# EAGLE design ft232-breakout (EAGLE 6.5.0)
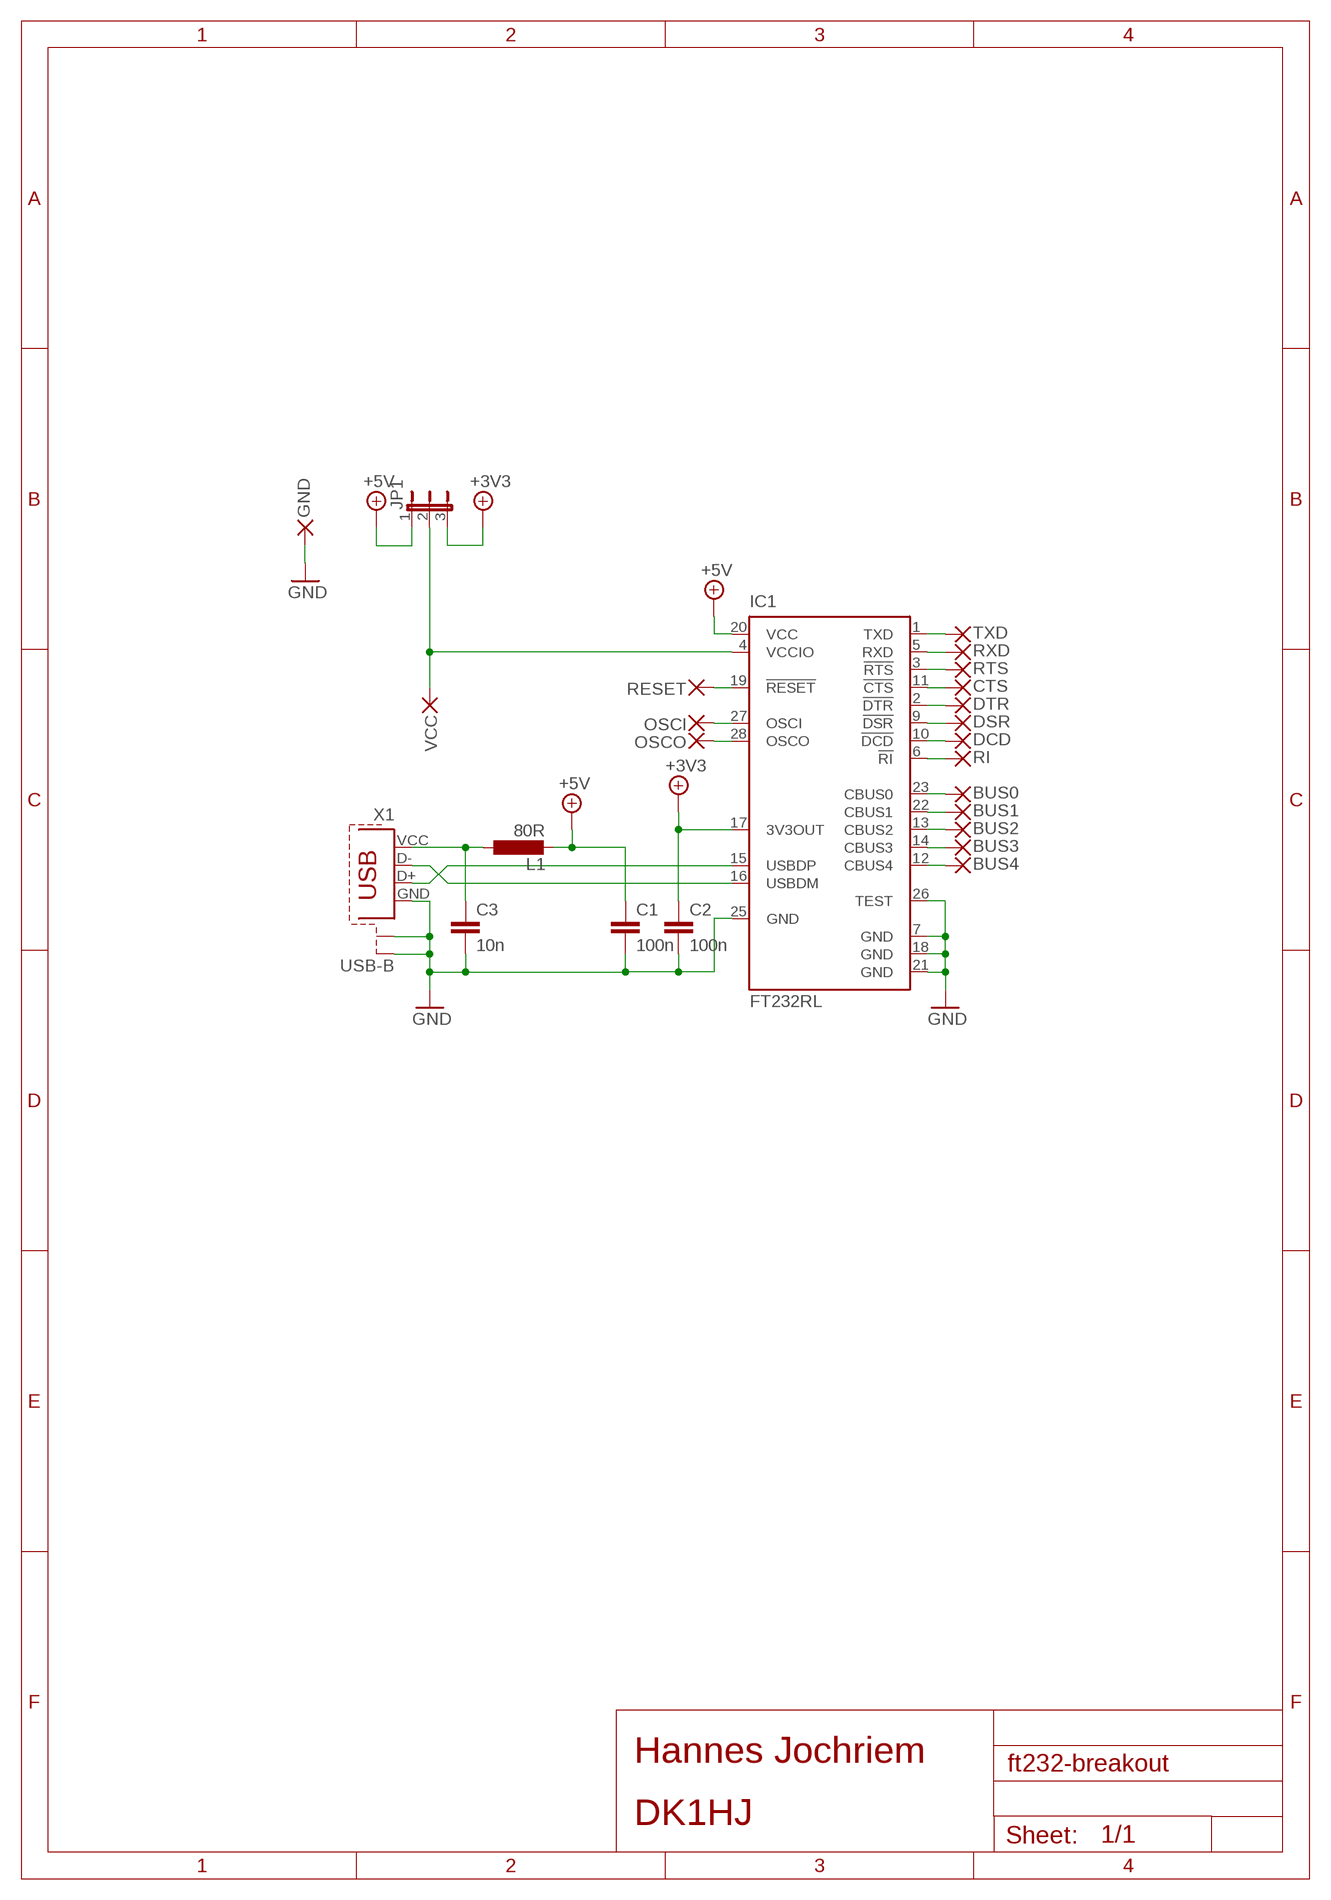
[diagram p0: schematic, sheet 1]

## Parts
BUS0  WIREPAD2,15/1,0  [2,15/1,0]
BUS1  WIREPAD2,15/1,0  [2,15/1,0]
BUS2  WIREPAD2,15/1,0  [2,15/1,0]
BUS3  WIREPAD2,15/1,0  [2,15/1,0]
BUS4  WIREPAD2,15/1,0  [2,15/1,0]
C1  100n  CC0805  [C0805]
C2  100n  CC0805  [C0805]
C3  10n  CC0805  [C0805]
CTS  WIREPAD2,15/1,0  [2,15/1,0]
DCD  WIREPAD2,15/1,0  [2,15/1,0]
DSR  WIREPAD2,15/1,0  [2,15/1,0]
DTR  WIREPAD2,15/1,0  [2,15/1,0]
GND  WIREPAD2,15/1,0  [2,15/1,0]
IC1  FT232RL  [SSOP28]
JP1  JP2E  [JP2]
L1  80R  LL2012C  [L2012C]
OSCI  WIREPAD2,15/1,0  [2,15/1,0]
OSCO  WIREPAD2,15/1,0  [2,15/1,0]
RESET  WIREPAD2,15/1,0  [2,15/1,0]
RI  WIREPAD2,15/1,0  [2,15/1,0]
RTS  WIREPAD2,15/1,0  [2,15/1,0]
RXD  WIREPAD2,15/1,0  [2,15/1,0]
TXD  WIREPAD2,15/1,0  [2,15/1,0]
VCC  WIREPAD2,15/1,0  [2,15/1,0]
X1  USB-B  [PN61729-S]

## Nets
+3V3: C2.1 IC1.17(3V3OUT) JP1.3
+5V: C1.1 IC1.20(VCC) JP1.1 L1.2
GND: C1.2 C2.2 C3.2 GND.1(P) IC1.7(GND) IC1.18(GND) IC1.21(GND) IC1.25(GND) IC1.26(TEST) X1.GND X1.S1 X1.S2
N$1: IC1.16(USBDM) X1.D-
N$2: IC1.15(USBDP) X1.D+
N$3: BUS3.1(P) IC1.14(CBUS3)
N$4: C3.1 L1.1 X1.VCC
N$5: BUS2.1(P) IC1.13(CBUS2)
N$6: BUS1.1(P) IC1.22(CBUS1)
N$8: BUS0.1(P) IC1.23(CBUS0)
N$9: IC1.6(!RI) RI.1(P)
N$10: BUS4.1(P) IC1.12(CBUS4)
N$11: DCD.1(P) IC1.10(!DCD)
N$12: DSR.1(P) IC1.9(!DSR)
N$13: DTR.1(P) IC1.2(!DTR)
N$14: CTS.1(P) IC1.11(!CTS)
N$15: IC1.3(!RTS) RTS.1(P)
N$16: IC1.5(RXD) RXD.1(P)
N$17: IC1.1(TXD) TXD.1(P)
N$18: IC1.19(!RESET) RESET.1(P)
N$19: IC1.27(OSCI) OSCI.1(P)
N$20: IC1.28(OSCO) OSCO.1(P)
N$21: IC1.4(VCCIO) JP1.2 VCC.1(P)

## Library data of the parts
BUS0 BUS1-BUS4 CTS DCD DSR DTR GND OSCI OSCO RESET RI RTS RXD TXD VCC = wirepad:WIREPAD: Wire PAD connect wire on PCB
C1-C3 = rcl:C: CAPACITOR, European symbol
IC1 = ftdichip:FT232R: Source: http://www.ftdichip.com/Documents/DataSheets/DS_FT232R_v104.pdf
JP1 = jumper:JP2E: JUMPER
L1 = rcl:L: INDUCTOR, European symbol
X1 = connectors:USB-B: BERG USB connector

## Board
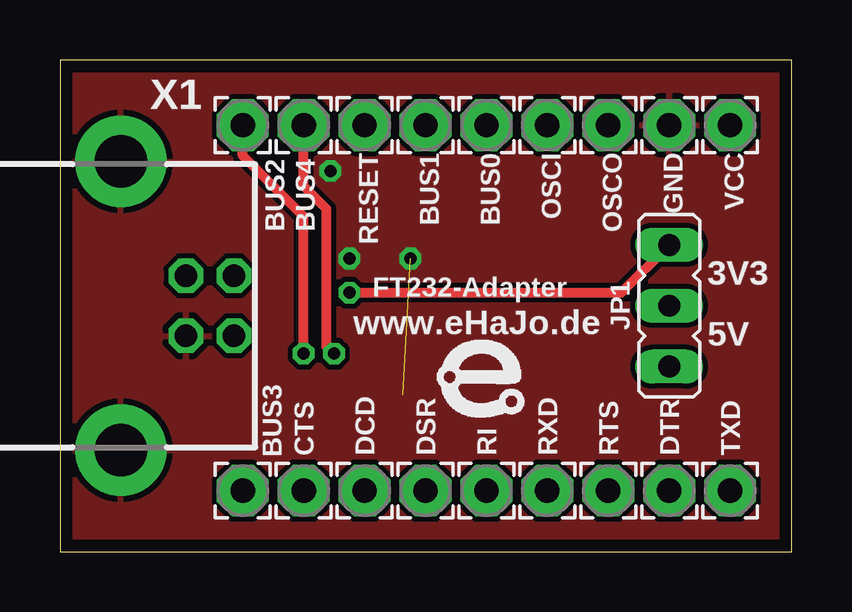
[diagram p1: board, top side]
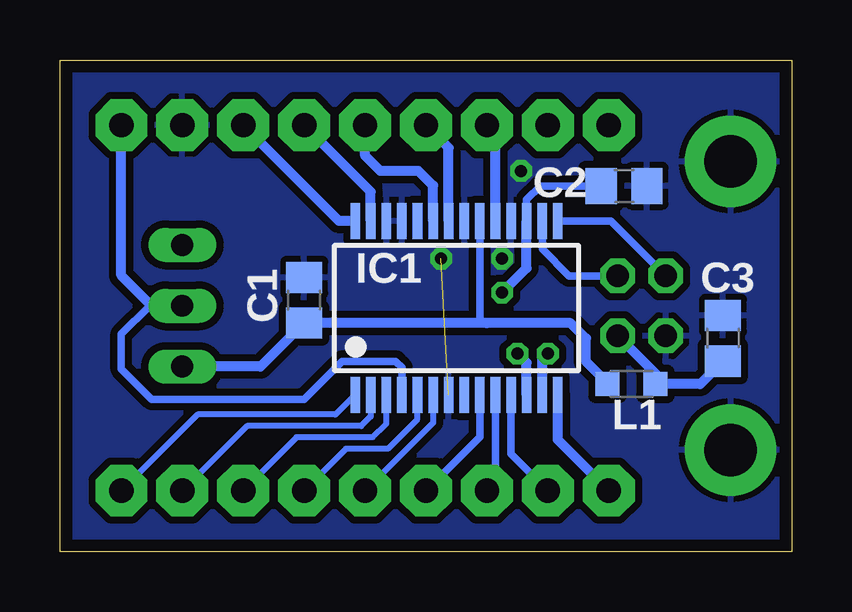
[diagram p2: board, bottom side, seen from below]

Size 30.5 x 20.5 mm. Coordinates in mm from the lower left corner, seen from the top.
Outline: 0,0 30.5,0 30.5,20.5 0,20.5 0,0
Copper layers (1*16): Top 0.035mm / dielectric 1.5mm / Bottom 0.035mm
Design rules "default *": minimum track width 10mil, minimum drill 24mil, track to track 8mil, track to pad 8mil, pad to pad 8mil, via to via 8mil, smd to smd 8mil, copper to edge 20mil, drill to drill 8mil, minimum pad ring 10mil, minimum via ring 8mil, stop-mask expansion 4mil, vias tented up to drill 0mil, thermal gap 10mil

### Footprints (pad centres in the part's own frame; a part is rotated, then mirrored left to right if it is on the bottom)
2,15/1,0 = drill 1.016 pad 2.159 octagon: 1 0,0
C0805 = smd 1.3 x 1.5: 1 -0.95,0; 2 0.95,0
SSOP28 = smd 0.4 x 1.5: 1 -4.225,-3.625; 2 -3.575,-3.625; 3 -2.925,-3.625; 4 -2.275,-3.625; 5 -1.625,-3.625; 6 -0.975,-3.625; 7 -0.325,-3.625; 8 0.325,-3.625; 9 0.975,-3.625; 10 1.625,-3.625; 11 2.275,-3.625; 12 2.925,-3.625; 13 3.575,-3.625; 14 4.225,-3.625; 15 4.225,3.625; 16 3.575,3.625; 17 2.925,3.625; 18 2.275,3.625; 19 1.625,3.625; 20 0.975,3.625; 21 0.325,3.625; 22 -0.325,3.625; 23 -0.975,3.625; 24 -1.625,3.625; 25 -2.275,3.625; 26 -2.925,3.625; 27 -3.575,3.625; 28 -4.225,3.625
JP2 = drill 0.914 long: 1 -2.54,0; 2 0,0; 3 2.54,0
L2012C = smd 1 x 1: 1 -1,0; 2 1,0
PN61729-S = drill 0.95 octagon: D+ -1.25,2.71; D- -1.25,4.71; GND 1.25,2.71; VCC 1.25,4.71 | drill 2.2 pad 3.81: S1 -6.02,0; S2 6.02,0

### Placement (x,y rotation side)
BUS0  17.78,17.78 0 top
BUS1  15.24,17.78 0 top
BUS2  7.62,17.78 0 top
BUS3  7.62,2.54 0 top
BUS4  10.16,17.78 0 top
C1  20.32,10.48 90 bottom
C2  6.99,15.24 0 bottom
C3  2.86,8.89 90 bottom
CTS  10.16,2.54 0 top
DCD  12.7,2.54 0 top
DSR  15.24,2.54 0 top
DTR  25.4,2.54 0 top
GND  25.4,17.78 0 top
IC1  13.97,10.16 0 bottom
JP1  25.4,10.25 90 top
L1  6.67,6.99 180 bottom
OSCI  20.32,17.78 0 top
OSCO  22.86,17.78 0 top
RESET  12.7,17.78 0 top
RI  17.78,2.54 0 top
RTS  22.86,2.54 0 top
RXD  20.32,2.54 0 top
TXD  27.94,2.54 0 top
VCC  27.94,17.78 0 top
X1  2.54,10.25 270 top

### Tracks (layer width: path | path; a pad name or v marks a point on that pad's centre or on a via)
+3V3  (via drill 0.5)
  Top 0.406: v12.06,10.79 23.41,10.79 JP1.3
  Bottom 0.305: C2.1 10.48,15.24 11.04,14.67 IC1.17
  Bottom 0.406: IC1.17 11.04,11.81 v12.06,10.79
+5V
  Bottom 0.305: IC1.20 12.99,9.53 12.7,9.53
  Bottom 0.406: JP1.1 22.14,7.71 C1.1 12.7,9.53 9.21,9.53 8.57,8.89 8.57,7.94 7.67,7.03 L1.2 7.94,6.99
GND  (via drill 0.5)  (1 unrouted)
  other vias: 11.27,15.88 12.06,12.22 14.61,12.22
  pour Bottom (isolate 0.305): 0,0 30.48,0 30.48,20.32 0,20.32
  pour Top: 0,20.32 0,0 30.48,0 30.48,20.32
N$1
  Bottom 0.305: IC1.16 10.39,12.62 9.28,11.5 X1.D-
N$2
  Bottom 0.254: 7.54,13.79 7.62,13.79
  Bottom 0.305: 7.62,13.79 IC1.15 | X1.D+ 7.54,13.79
N$3
  Bottom 0.406: IC1.14 9.74,4.67 BUS3.1
N$4
  Bottom 0.406: C3.1 3.81,6.99 L1.1 5.67,7.42 X1.VCC
N$5  (via drill 0.5)
  Top 0.406: v10.16,8.26 10.16,13.97 7.62,16.51 BUS2.1
  Bottom 0.406: IC1.13 10.39,8.02 v10.16,8.26
N$6
  Bottom 0.406: IC1.22 14.29,16.84 BUS1.1
N$8
  Bottom 0.406: IC1.23 14.95,15.26 15.56,15.88 17.14,15.88 17.78,16.51 BUS0.1
N$9
  Bottom 0.254: RI.1 16.51,3.81 14.95,5.38 IC1.6
N$10  (via drill 0.5)
  Top 0.406: v11.43,8.26 11.11,8.57 11.11,14.29 10.16,15.24 BUS4.1
  Bottom 0.406: IC1.12 11.04,7.87 v11.43,8.26
N$11
  Bottom 0.305: DCD.1 12.35,2.9 IC1.10
N$12
  Bottom 0.305: DSR.1 13.97,3.81 12.99,4.79 IC1.9
N$13
  Bottom 0.254: IC1.2 17.55,5.63 17.94,5.24 22.7,5.24 DTR.1
N$14
  Bottom 0.305: CTS.1 11.7,4.08 IC1.11
N$15
  Bottom 0.254: IC1.3 16.89,5.33 17.46,4.76 20.64,4.76 RTS.1
N$16
  Bottom 0.254: IC1.5 15.6,5.52 16.83,4.29 18.57,4.29 RXD.1
N$17
  Bottom 0.254: TXD.1 24.77,5.71 19.02,5.71 IC1.1
N$18
  Bottom 0.406: IC1.19 12.35,17.43 RESET.1
N$19
  Bottom 0.406: IC1.27 17.55,15.01 OSCI.1
N$20
  Bottom 0.406: IC1.28 18.86,13.79 OSCO.1
N$21
  Bottom 0.305: IC1.4 16.25,7.67 16.51,7.94 18.73,7.94 20.32,6.35 26.67,6.35 27.94,7.62 27.94,9.07 26.76,10.25 26.67,10.25 JP1.2
  Bottom 0.406: VCC.1 27.94,11.52 26.67,10.25

### Text on the board
tNames: FT232-Adapter | 3V3 | www.eHaJo.de | 5V